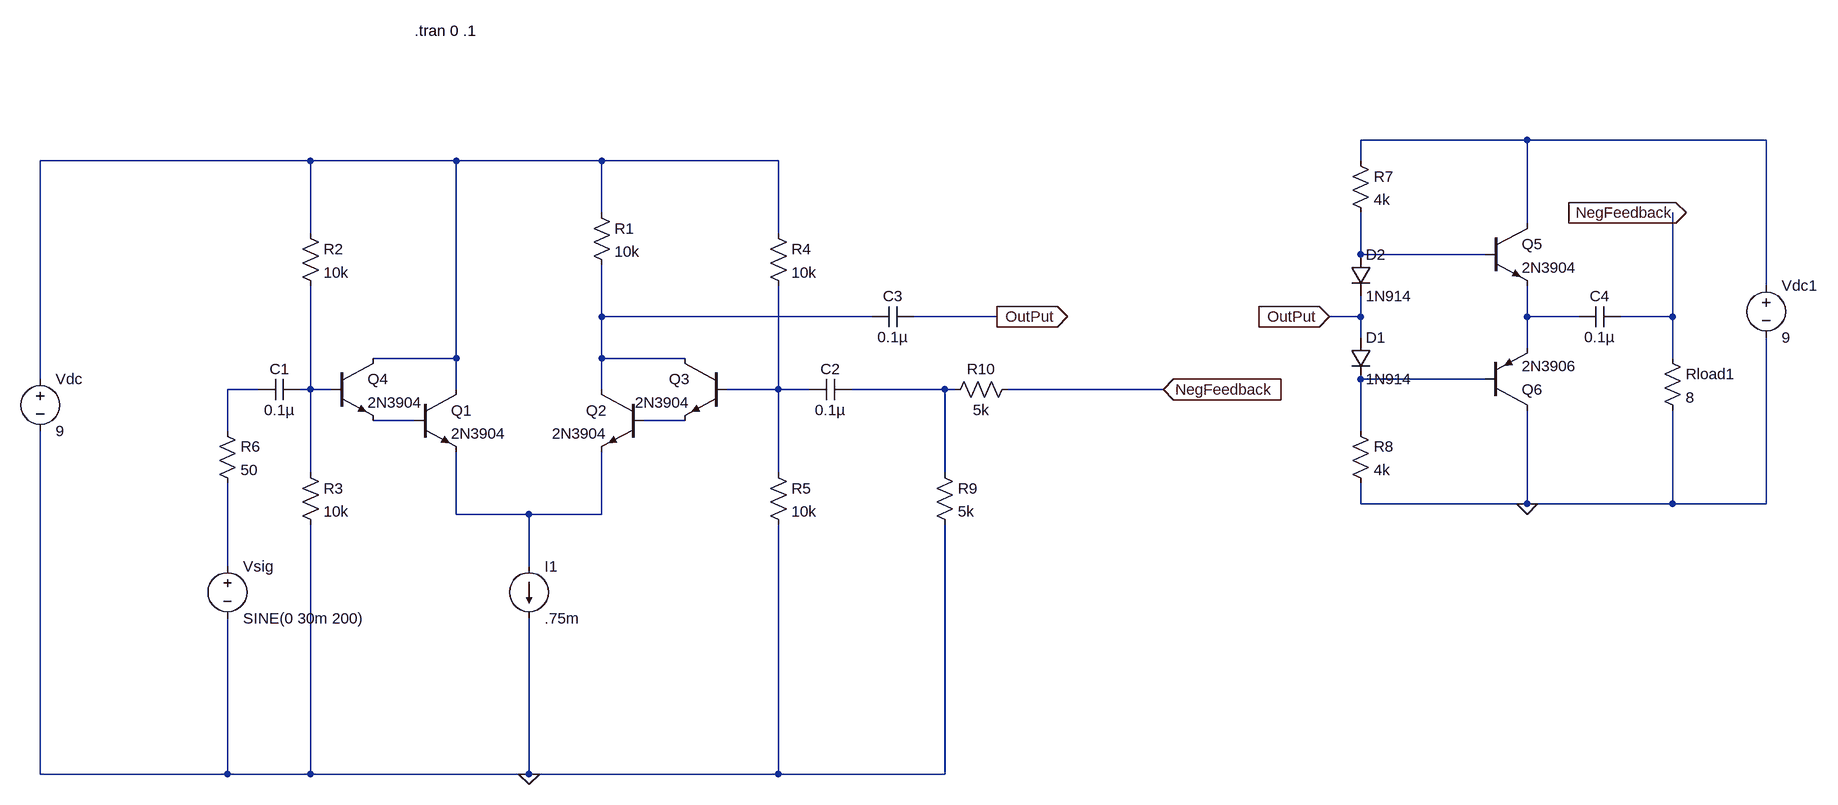
[diagram p0: schematic DiffPair_AB.asc]
DiffPair_AB.asc, the LTspice schematic file:
Version 4
SHEET 1 2340 880
WIRE 1888 -144 1632 -144
WIRE 2256 -144 1888 -144
WIRE 16 -112 -400 -112
WIRE 240 -112 16 -112
WIRE 464 -112 240 -112
WIRE 736 -112 464 -112
WIRE 1632 -112 1632 -144
WIRE 464 -32 464 -112
WIRE 1888 -16 1888 -144
WIRE 16 0 16 -112
WIRE 736 0 736 -112
WIRE 1632 32 1632 -32
WIRE 1824 32 1632 32
WIRE 2256 80 2256 -144
WIRE 464 128 464 48
WIRE 880 128 464 128
WIRE 1072 128 944 128
WIRE 1632 128 1632 96
WIRE 1632 128 1584 128
WIRE 1888 128 1888 80
WIRE 1968 128 1888 128
WIRE 2112 128 2112 -32
WIRE 2112 128 2032 128
WIRE 1632 160 1632 128
WIRE 1888 176 1888 128
WIRE 240 192 240 -112
WIRE 240 192 112 192
WIRE 464 192 464 128
WIRE 592 192 464 192
WIRE 2112 192 2112 128
WIRE -400 224 -400 -112
WIRE 1824 224 1632 224
WIRE -64 240 -112 240
WIRE 16 240 16 80
WIRE 16 240 0 240
WIRE 48 240 16 240
WIRE 240 240 240 192
WIRE 464 240 464 192
WIRE 736 240 736 80
WIRE 736 240 656 240
WIRE 784 240 736 240
WIRE 992 240 848 240
WIRE 1008 240 992 240
WIRE 1328 240 1088 240
WIRE 176 288 112 288
WIRE 592 288 528 288
WIRE -112 304 -112 240
WIRE 1632 304 1632 224
WIRE 16 368 16 240
WIRE 736 368 736 240
WIRE 992 368 992 240
WIRE 1632 416 1632 384
WIRE 1888 416 1888 272
WIRE 1888 416 1632 416
WIRE 2112 416 2112 272
WIRE 2112 416 1888 416
WIRE 2256 416 2256 160
WIRE 2256 416 2112 416
WIRE 240 432 240 336
WIRE 352 432 240 432
WIRE 464 432 464 336
WIRE 464 432 352 432
WIRE -112 512 -112 384
WIRE 352 512 352 432
WIRE -400 832 -400 304
WIRE -112 832 -112 592
WIRE -112 832 -400 832
WIRE 16 832 16 448
WIRE 16 832 -112 832
WIRE 352 832 352 592
WIRE 352 832 16 832
WIRE 736 832 736 448
WIRE 736 832 352 832
WIRE 992 832 992 448
WIRE 992 832 736 832
FLAG 352 832 0
FLAG 1072 128 OutPut
IOPIN 1072 128 Out
FLAG 1328 240 NegFeedback
IOPIN 1328 240 In
FLAG 1888 416 0
FLAG 1584 128 OutPut
IOPIN 1584 128 In
FLAG 1952 -32 NegFeedback
IOPIN 1952 -32 Out
SYMBOL npn 176 240 R0
SYMATTR InstName Q1
SYMATTR Value 2N3904
SYMBOL npn 528 240 M0
SYMATTR InstName Q2
SYMATTR Value 2N3904
SYMBOL npn 656 192 M0
SYMATTR InstName Q3
SYMATTR Value 2N3904
SYMBOL npn 48 192 R0
SYMATTR InstName Q4
SYMATTR Value 2N3904
SYMBOL res 448 -48 R0
SYMATTR InstName R1
SYMATTR Value 10k
SYMBOL current 352 512 R0
SYMATTR InstName I1
SYMATTR Value .75m
SYMBOL voltage -400 208 R0
SYMATTR InstName Vdc
SYMATTR Value 9
SYMBOL cap 0 224 R90
WINDOW 0 0 32 VBottom 2
WINDOW 3 32 32 VTop 2
SYMATTR InstName C1
SYMATTR Value 0.1µ
SYMBOL voltage -112 496 R0
SYMATTR InstName Vsig
SYMATTR Value SINE(0 30m 200)
SYMBOL res 0 -16 R0
SYMATTR InstName R2
SYMATTR Value 10k
SYMBOL res 0 352 R0
SYMATTR InstName R3
SYMATTR Value 10k
SYMBOL cap 848 224 R90
WINDOW 0 0 32 VBottom 2
WINDOW 3 32 32 VTop 2
SYMATTR InstName C2
SYMATTR Value 0.1µ
SYMBOL res 720 -16 R0
SYMATTR InstName R4
SYMATTR Value 10k
SYMBOL res 720 352 R0
SYMATTR InstName R5
SYMATTR Value 10k
SYMBOL res -128 288 R0
SYMATTR InstName R6
SYMATTR Value 50
SYMBOL cap 944 112 R90
WINDOW 0 0 32 VBottom 2
WINDOW 3 32 32 VTop 2
SYMATTR InstName C3
SYMATTR Value 0.1µ
SYMBOL npn 1824 -16 R0
SYMATTR InstName Q5
SYMATTR Value 2N3904
SYMBOL pnp 1824 272 M180
SYMATTR InstName Q6
SYMATTR Value 2N3906
SYMBOL res 2096 176 R0
SYMATTR InstName Rload1
SYMATTR Value 8
SYMBOL cap 2032 112 R90
WINDOW 0 0 32 VBottom 2
WINDOW 3 32 32 VTop 2
SYMATTR InstName C4
SYMATTR Value 0.1µ
SYMBOL res 1616 -128 R0
SYMATTR InstName R7
SYMATTR Value 4k
SYMBOL diode 1616 160 R0
SYMATTR InstName D1
SYMATTR Value 1N914
SYMBOL diode 1616 32 R0
SYMATTR InstName D2
SYMATTR Value 1N914
SYMBOL res 1616 288 R0
SYMATTR InstName R8
SYMATTR Value 4k
SYMBOL voltage 2256 64 R0
SYMATTR InstName Vdc1
SYMATTR Value 9
SYMBOL res 976 352 R0
SYMATTR InstName R9
SYMATTR Value 5k
SYMBOL res 1104 224 R90
WINDOW 0 0 56 VBottom 2
WINDOW 3 32 56 VTop 2
SYMATTR InstName R10
SYMATTR Value 5k
TEXT 176 -312 Left 2 !.tran 0 .1

The netlist it stands for:
* DiffPair_AB.asc
Q1 N002 N012 N014 0 2N3904
Q2 N004 N013 N014 0 2N3904
Q3 N004 N010 N013 0 2N3904
Q4 N002 N009 N012 0 2N3904
R1 N002 N004 10k
I1 N014 0 .75m
Vdc N002 0 9
C1 N009 N008 0.1µ
Vsig N015 0 SINE(0 30m 200)
R2 N002 N009 10k
R3 N009 0 10k
C2 N011 N010 0.1µ
R4 N002 N010 10k
R5 N010 0 10k
R6 N008 N015 50
C3 OutPut N004 0.1µ
Q5 N001 N003 N005 0 2N3904
Q6 0 N007 N005 0 2N3906
Rload1 N006 0 8
C4 N006 N005 0.1µ
R7 N001 N003 4k
D1 OutPut N007 1N914
D2 N003 OutPut 1N914
R8 N007 0 4k
Vdc1 N001 0 9
R9 N011 0 5k
R10 NegFeedback N011 5k
.model D D
.lib standard.dio
.model NPN NPN
.model PNP PNP
.lib standard.bjt
.tran 0 .1
.backanno
.end